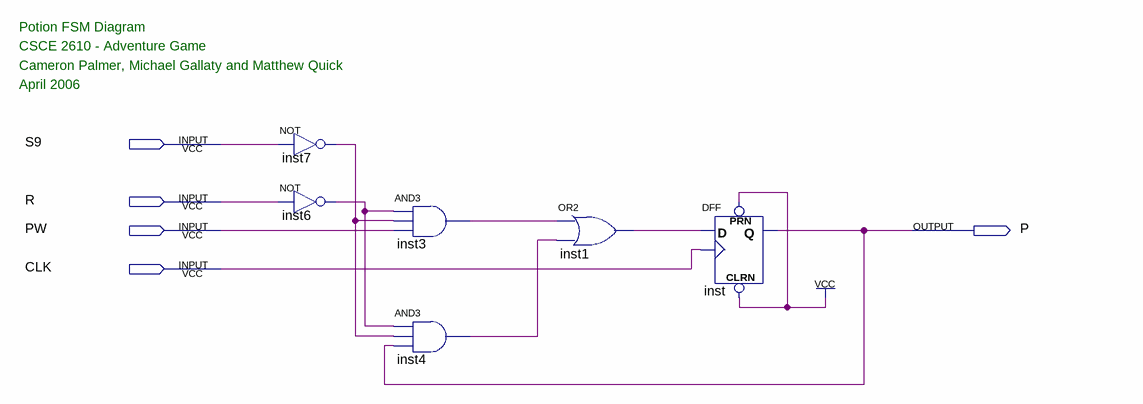
[diagram p0: schematic sheet]
// Quartus schematic potion_fsm.bdf as structural Verilog: 6 symbols, 5 pins
module potion_fsm (
  input  S9,
  input  R,
  input  PW,
  input  CLK,
  output P
);

  wire inst1_out, inst3_out, inst4_out, inst6_out, inst7_out;

  not inst7 (inst7_out, S9);
  not inst6 (inst6_out, R);
  and inst3 (inst3_out, inst6_out, inst7_out, PW);
  and inst4 (inst4_out, inst6_out, inst7_out, P);
  or inst1 (inst1_out, inst3_out, inst4_out);
  DFF inst (.CLRN(1'b1), .CLK(CLK), .D(inst1_out), .PRN(1'b1), .Q(P));

  // Notes on the sheet:
  //   Potion FSM Diagram
  //   CSCE 2610 - Adventure Game
  //   Cameron Palmer, Michael Gallaty and Matthew Quick
  //   April 2006
endmodule
